# Altium project AT91SAM7S_Demo1.PrjPcb
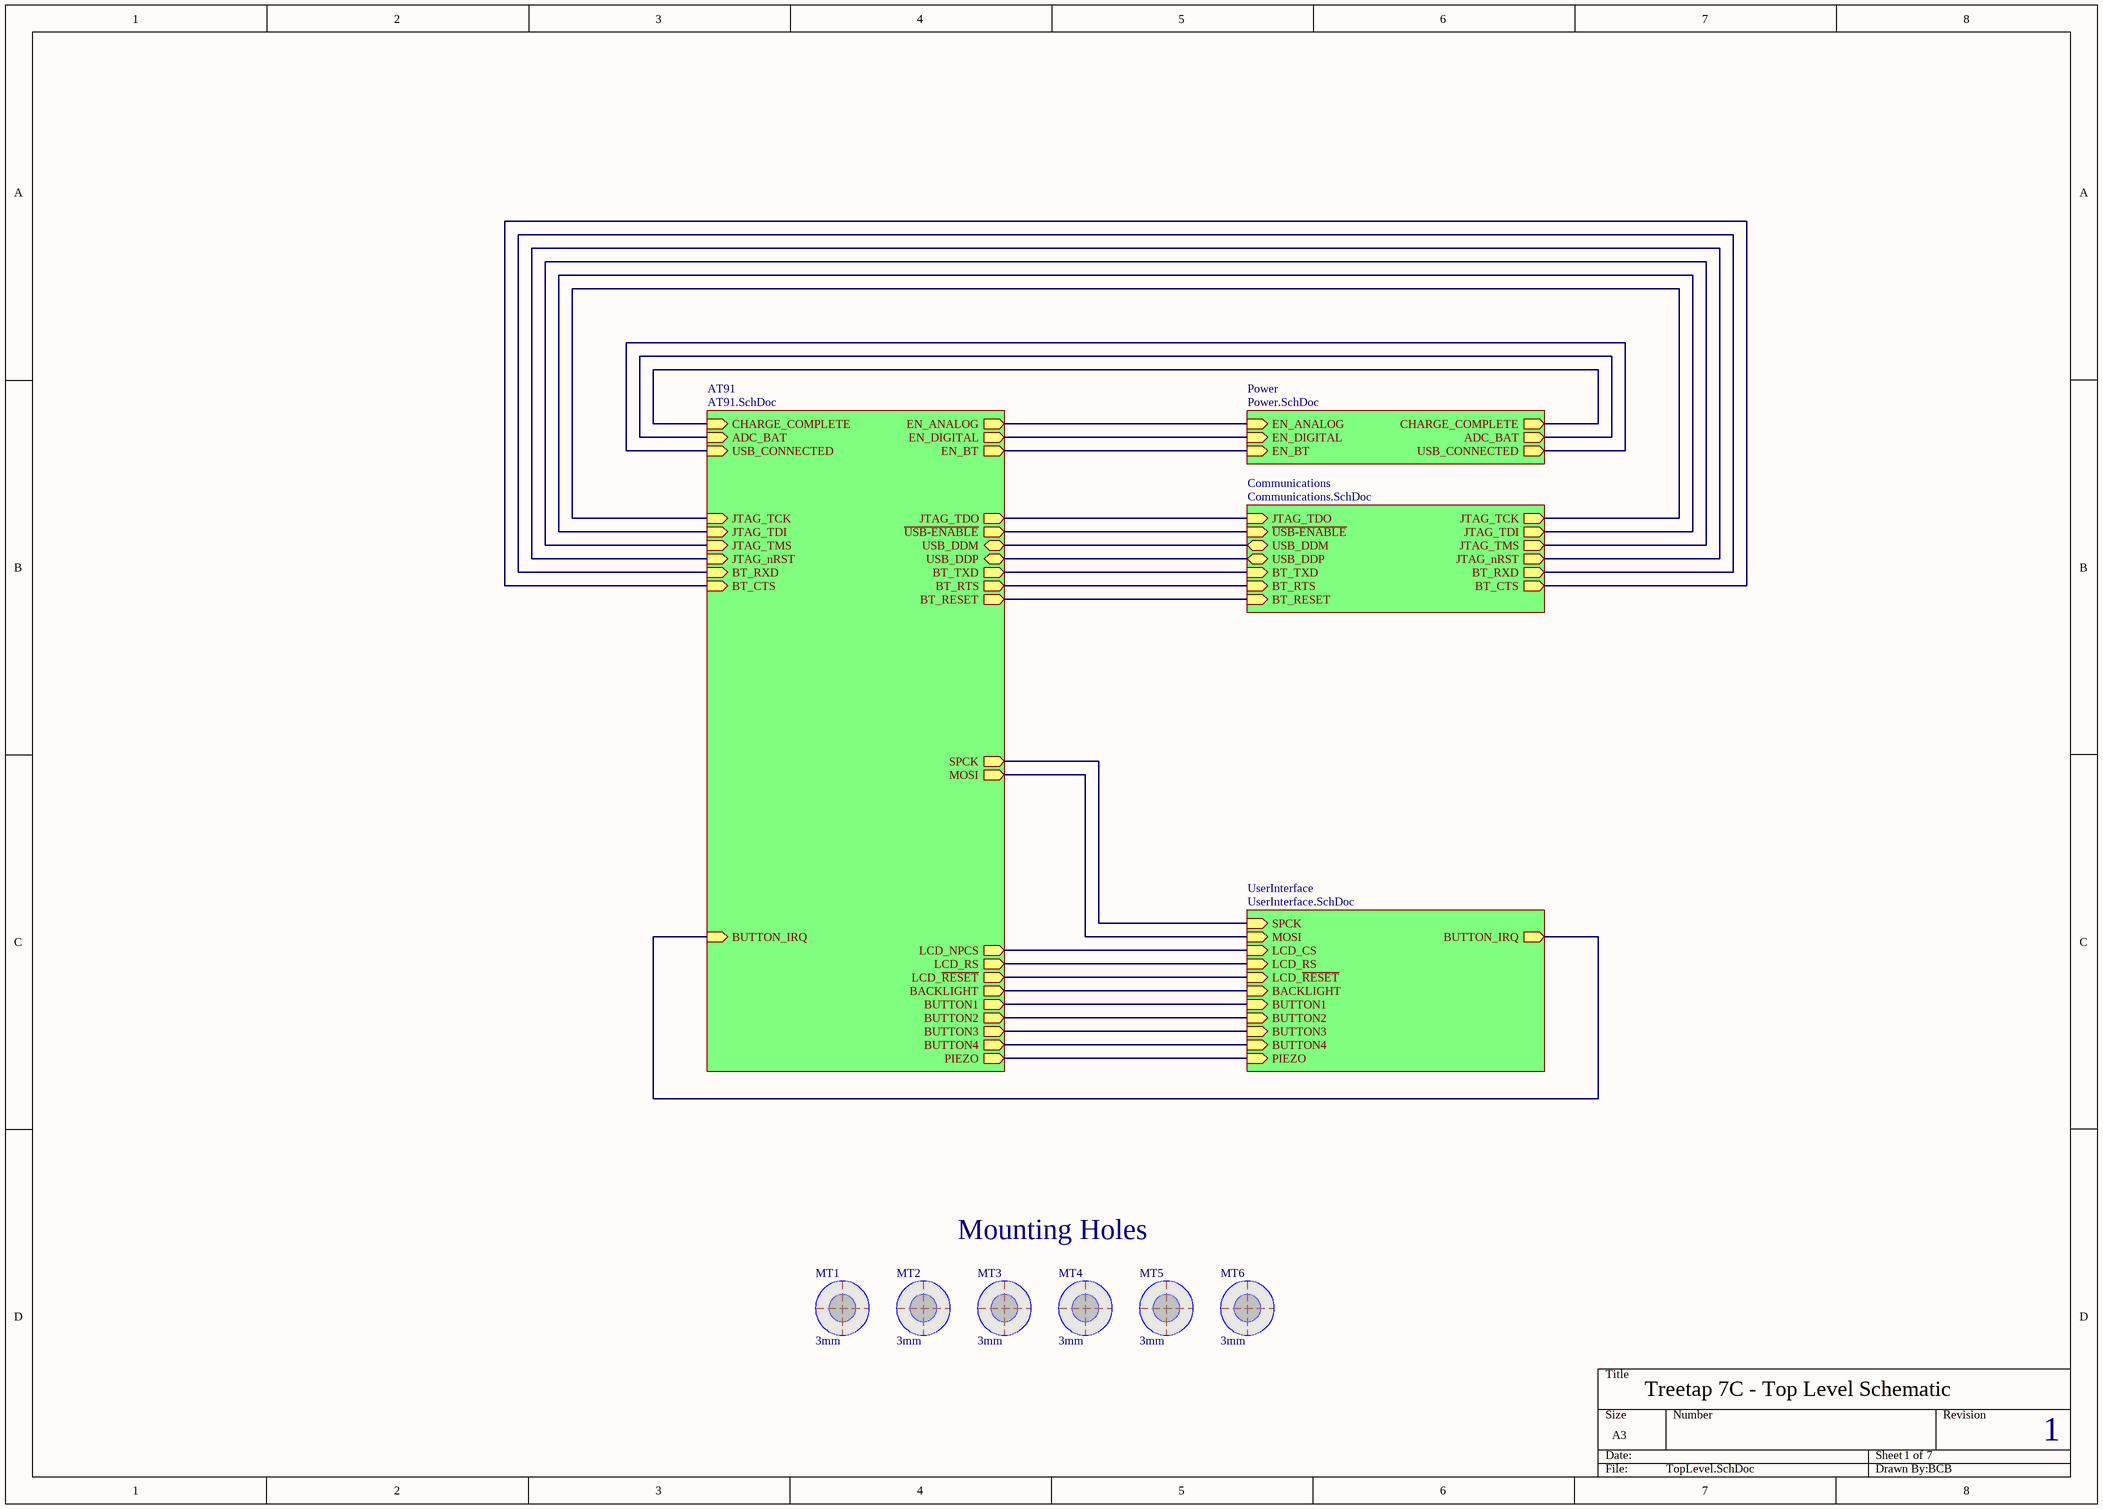
[diagram p0: TopLevel.SchDoc]
5 sheets, 130 parts. Net scope: hierarchical (ports join the sheet entries above them; power ports are global).
Sheets:
  TopLevel.SchDoc
    AT91 = AT91.SchDoc
    Power = Power.SchDoc
    Communications = Communications.SchDoc
    UserInterface = UserInterface.SchDoc

## Sheet TopLevel.SchDoc: Treetap 7C - Top Level Schematic
size A3; Author: Treetap Group; DrawnBy: Treetap Group; Revision: 1; SheetNumber: 1; SheetTotal: 7

### Parts
MT1  3mm  [MNT-HOLE_3mmNPTH]  (no BOM)
MT2  3mm  [MNT-HOLE_3mmNPTH]  (no BOM)
MT3  3mm  [MNT-HOLE_3mmNPTH]  (no BOM)
MT4  3mm  [MNT-HOLE_3mmNPTH]  (no BOM)
MT5  3mm  [MNT-HOLE_3mmNPTH]  (no BOM)
MT6  3mm  [MNT-HOLE_3mmNPTH]  (no BOM)

### Sub-sheets
AT91 = AT91.SchDoc: MOSI (out), SPCK (out), ADC_BAT (in), BUTTON_IRQ (in), BUTTON1 (out), BUTTON2 (out), BT_RESET (out), PIEZO (out), BUTTON3 (out), CHARGE_COMPLETE (in), LCD_NPCS (out), LCD_RS (out), BT_RXD (in), BT_TXD (out), BT_CTS (in), JTAG_TMS (in), JTAG_TCK (in), JTAG_TDO (out), JTAG_TDI (in), JTAG_nRST (in), EN_DIGITAL (out), EN_ANALOG (out), BT_RTS (out), USB_DDM (bidir), USB_DDP (bidir), EN_BT (out), LCD_~{RESET} (out), BACKLIGHT (out), USB_CONNECTED (in), BUTTON4 (out), ~{USB-ENABLE} (out)
Communications = Communications.SchDoc: JTAG_TCK (out), JTAG_TDI (out), JTAG_TDO (in), JTAG_TMS (out), JTAG_nRST (out), USB_DDM (bidir), USB_DDP (bidir), BT_RXD (out), BT_TXD (in), BT_CTS (out), BT_RTS (in), BT_RESET (in), ~{USB-ENABLE} (in)
Power = Power.SchDoc: EN_ANALOG (in), EN_DIGITAL (in), EN_BT (in), CHARGE_COMPLETE (out), ADC_BAT (out), USB_CONNECTED (out)
UserInterface = UserInterface.SchDoc: LCD_RS (in), SPCK (in), MOSI (in), PIEZO (in), BUTTON1 (in), BUTTON2 (in), BUTTON_IRQ (out), BUTTON3 (in), LCD_CS (in), BACKLIGHT (in), LCD_~{RESET} (in), BUTTON4 (in)

### Nets
ADC_BAT: sheet AT91/ADC_BAT, sheet Power/ADC_BAT
BACKLIGHT: sheet AT91/BACKLIGHT, sheet UserInterface/BACKLIGHT
BT_CTS: sheet AT91/BT_CTS, sheet Communications/BT_CTS
BT_RESET: sheet AT91/BT_RESET, sheet Communications/BT_RESET
BT_RTS: sheet AT91/BT_RTS, sheet Communications/BT_RTS
BT_RXD: sheet AT91/BT_RXD, sheet Communications/BT_RXD
BT_TXD: sheet AT91/BT_TXD, sheet Communications/BT_TXD
BUTTON1: sheet AT91/BUTTON1, sheet UserInterface/BUTTON1
BUTTON2: sheet AT91/BUTTON2, sheet UserInterface/BUTTON2
BUTTON3: sheet AT91/BUTTON3, sheet UserInterface/BUTTON3
BUTTON4: sheet AT91/BUTTON4, sheet UserInterface/BUTTON4
BUTTON_IRQ: sheet AT91/BUTTON_IRQ, sheet UserInterface/BUTTON_IRQ
CHARGE_COMPLETE: sheet AT91/CHARGE_COMPLETE, sheet Power/CHARGE_COMPLETE
DDM: sheet AT91/USB_DDM, sheet Communications/USB_DDM
DDP: sheet AT91/USB_DDP, sheet Communications/USB_DDP
EN_ANALOG: sheet AT91/EN_ANALOG, sheet Power/EN_ANALOG
EN_BT: sheet AT91/EN_BT, sheet Power/EN_BT
EN_DIGITAL: sheet AT91/EN_DIGITAL, sheet Power/EN_DIGITAL
LCD_NPCS: sheet AT91/LCD_NPCS, sheet UserInterface/LCD_CS
LCD_RESET: sheet AT91/LCD_~{RESET}, sheet UserInterface/LCD_~{RESET}
LCD_RS: sheet AT91/LCD_RS, sheet UserInterface/LCD_RS
MOSI: sheet AT91/MOSI, sheet UserInterface/MOSI
NRST: sheet AT91/JTAG_nRST, sheet Communications/JTAG_nRST
PIEZO: sheet AT91/PIEZO, sheet UserInterface/PIEZO
SPCK: sheet AT91/SPCK, sheet UserInterface/SPCK
TCK: sheet AT91/JTAG_TCK, sheet Communications/JTAG_TCK
TDI: sheet AT91/JTAG_TDI, sheet Communications/JTAG_TDI
TDO: sheet AT91/JTAG_TDO, sheet Communications/JTAG_TDO
TMS: sheet AT91/JTAG_TMS, sheet Communications/JTAG_TMS
USB_CONNECTED: sheet AT91/USB_CONNECTED, sheet Power/USB_CONNECTED
USB_ENABLE: sheet AT91/~{USB-ENABLE}, sheet Communications/~{USB-ENABLE}

### Notes on the sheet
- Mounting Holes
- Treetap 7C - Top Level Schematic
- 1
- 7
- BCB

### Library data of the parts
MT1-MT6 = MNT-HOLE_3mmNPTH: 3mm Mount hole NPTH; ECE_Component_Code: MNT-HOLE_3.2mmNPTH; Supplier_Component_Code: -; published: 12/03/2007 11:34:37 a.m.; Supplier_Name: -; price: 0; value: 3mm

## Sheet AT91.SchDoc: Treetap 7C - Microprocessor
size A3; Author: Treetap Group; DrawnBy: Treetap Group; Revision: 1; SheetNumber: 2; SheetTotal: 7; PageSetup: Record=PageOptions|CenterHorizontal=True|CenterVertical=True|PrintScale=1.01|XCorrection=1.00|YCorrection=1.00|PrintKind=1|BorderSize=5000000|LeftOffset=0|BottomOffset=0|Orientation=2|PaperLength=1000|PaperWidth=1000|Scale=100|PaperSource=15|PrintQuality=600|MediaType=1|DitherType=10|PaperKind=A3|PrintScaleMode=1
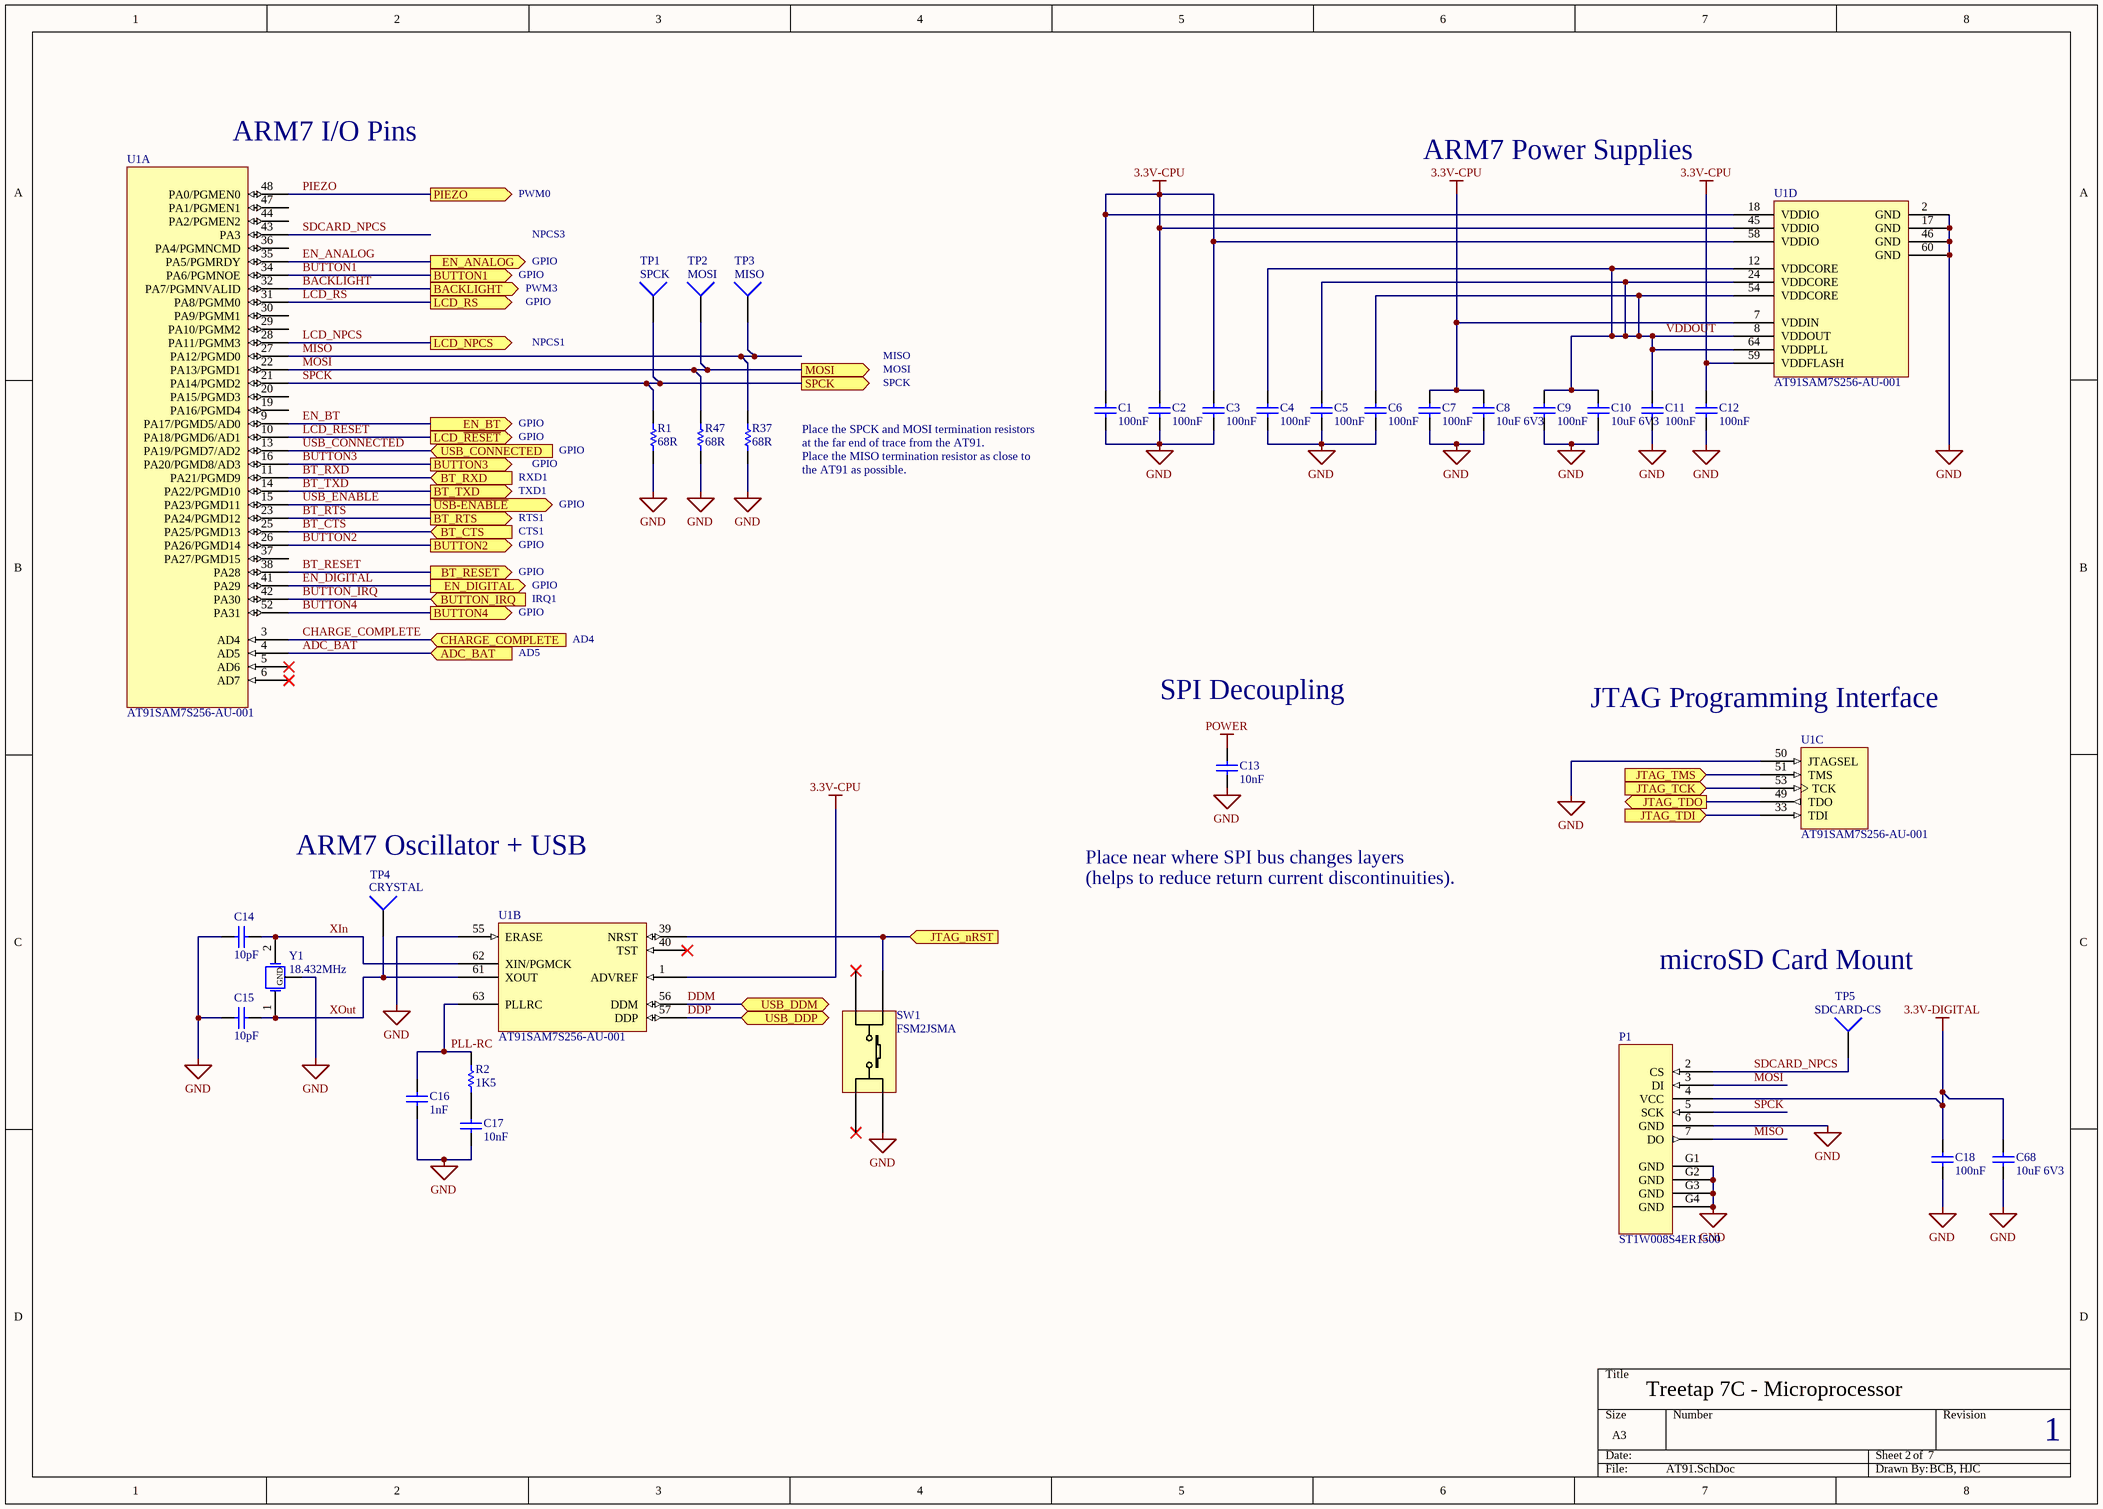
[diagram p1: AT91.SchDoc]

### Parts
C1  100nF  [CC0603]
C2  100nF  [CC0603]
C3  100nF  [CC0603]
C4  100nF  [CC0603]
C5  100nF  [CC0603]
C6  100nF  [CC0603]
C7  100nF  [CC0603]
C8  10uF 6V3  [CC0603]
C9  100nF  [CC0603]
C10  10uF 6V3  [CC0603]
C11  100nF  [CC0603]
C12  100nF  [CC0603]
C13  10nF  [CC0603]
C14  10pF  [CC0603]
C15  10pF  [CC0603]
C16  1nF  [CC0603]
C17  10nF  [CC0603]
C18  100nF  [CC0603]
C68  10uF 6V3  [CC0603]
P1  ST1W008S4ER1500  [ST1W008S4ER1500]
R1  68R  [R0603]
R2  1K5  [R0603]
R37  68R  [R0603]
R47  68R  [R0603]
SW1  FSM2JSMA  [FSM2JSMA]
TP1  SPCK  [SMTP_1]
TP2  MOSI  [SMTP_1]
TP3  MISO  [SMTP_1]
TP4  CRYSTAL  [SMTP_1]
TP5  SDCARD-CS  [SMTP_1]
U1  AT91SAM7S256-AU-001  [LQFP64_L]  (parts A,B,C,D of 4)
Y1  18.432MHz  [ABM10-18.432MHZ-E20-T]

### Ports
ADC_BAT (in), BACKLIGHT (out), BT_CTS (in), BT_RESET (out), BT_RTS (out), BT_RXD (in), BT_TXD (out), BUTTON1 (out), BUTTON2 (out), BUTTON3 (out), BUTTON4 (out), BUTTON_IRQ (in), CHARGE_COMPLETE (in), EN_ANALOG (out), EN_BT (out), EN_DIGITAL (out), JTAG_nRST (in), JTAG_TCK (in), JTAG_TDI (in), JTAG_TDO (out), JTAG_TMS (in), LCD_NPCS (out), LCD_RS (out), LCD_~{RESET} (out), MOSI (out), PIEZO (out), SPCK (out), USB_CONNECTED (in), USB_DDM (bidir), USB_DDP (bidir), ~{USB-ENABLE} (out)

### Nets
3.3V-CPU: C1.2 C2.2 C3.1 C7.1 C8.2 C12.2 U1.1(ADVREF) U1.7(VDDIN) U1.18(VDDIO) U1.45(VDDIO) U1.58(VDDIO) U1.59(VDDFLASH)
3.3V-DIGITAL: C18.2 C68.2 P1.4(VCC)
GND: C1.1 C2.1 C3.2 C4.1 C5.1 C6.1 C7.2 C8.1 C9.2 C10.1 C11.1 C12.1 C13.1 C14.2 C15.1 C16.1 C17.1 C18.1 C68.1 P1.6(GND) P1.G1(GND) P1.G2(GND) P1.G3(GND) P1.G4(GND) R1.1 R37.1 R47.1 SW1.4 U1.2(GND) U1.17(GND) U1.46(GND) U1.50(JTAGSEL) U1.55(ERASE) U1.60(GND) Y1.G(GND)
POWER: C13.2
ADC_BAT: U1.4(AD5) ; port ADC_BAT
BACKLIGHT: U1.32(PA7/PGMNVALID) ; port BACKLIGHT
BT_CTS: U1.25(PA25/PGMD13) ; port BT_CTS
BT_RESET: U1.38(PA28) ; port BT_RESET
BT_RTS: U1.23(PA24/PGMD12) ; port BT_RTS
BT_RXD: U1.11(PA21/PGMD9) ; port BT_RXD
BT_TXD: U1.14(PA22/PGMD10) ; port BT_TXD
BUTTON1: U1.34(PA6/PGMNOE) ; port BUTTON1
BUTTON2: U1.26(PA26/PGMD14) ; port BUTTON2
BUTTON3: U1.16(PA20/PGMD8/AD3) ; port BUTTON3
BUTTON4: U1.52(PA31) ; port BUTTON4
BUTTON_IRQ: U1.42(PA30) ; port BUTTON_IRQ
CHARGE_COMPLETE: U1.3(AD4) ; port CHARGE_COMPLETE
DDM: U1.56(DDM) ; port USB_DDM
DDP: U1.57(DDP) ; port USB_DDP
EN_ANALOG: U1.35(PA5/PGMRDY) ; port EN_ANALOG
EN_BT: U1.9(PA17/PGMD5/AD0) ; port EN_BT
EN_DIGITAL: U1.41(PA29) ; port EN_DIGITAL
LCD_NPCS: U1.28(PA11/PGMM3) ; port LCD_NPCS
LCD_RESET: U1.10(PA18/PGMD6/AD1) ; port LCD_~{RESET}
LCD_RS: U1.31(PA8/PGMM0) ; port LCD_RS
MISO: P1.7(DO) R37.2 TP3.1 U1.27(PA12/PGMD0)
MOSI: P1.3(DI) R47.2 TP2.1 U1.22(PA13/PGMD1) ; port MOSI
NRST: SW1.1 U1.39(NRST) ; port JTAG_nRST
PIEZO: U1.48(PA0/PGMEN0) ; port PIEZO
PLL-RC: C16.2 R2.2 U1.63(PLLRC)
SDCARD_NPCS: P1.2(CS) TP5.1 U1.43(PA3)
SPCK: P1.5(SCK) R1.2 TP1.1 U1.21(PA14/PGMD2) ; port SPCK
TCK: U1.53(TCK) ; port JTAG_TCK
TDI: U1.33(TDI) ; port JTAG_TDI
TDO: U1.49(TDO) ; port JTAG_TDO
TMS: U1.51(TMS) ; port JTAG_TMS
USB_CONNECTED: U1.13(PA19/PGMD7/AD2) ; port USB_CONNECTED
USB_ENABLE: U1.15(PA23/PGMD11) ; port ~{USB-ENABLE}
VDDOUT: C4.2 C5.2 C6.2 C9.1 C10.2 C11.2 U1.8(VDDOUT) U1.12(VDDCORE) U1.24(VDDCORE) U1.54(VDDCORE) U1.64(VDDPLL)
XIn: C14.1 U1.62(XIN/PGMCK) Y1.2(OSC2)
XOut: C15.2 TP4.1 U1.61(XOUT) Y1.1(OSC1)
NetC17_2: C17.2 R2.1

Not connected (* = marked no-connect by the designer): SW1 2* 3*; U1 5(AD6)* 6(AD7)* 19(PA16/PGMD4) 20(PA15/PGMD3) 29(PA10/PGMM2) 30(PA9/PGMM1) 36(PA4/PGMNCMD) 37(PA27/PGMD15) 40(TST)* 44(PA2/PGMEN2) 47(PA1/PGMEN1)

### Notes on the sheet
- (near U1) ARM7 I/O Pins
- ARM7 Power Supplies
- PWM0
- NPCS3
- GPIO
- PWM3
- NPCS1
- MISO
- MOSI
- (near C1) Place the SPCK and MOSI termination resistors
- at the far end of trace from the AT91.
- SPCK
- RXD1
- TXD1
- Place the MISO termination resistor as close to
- the AT91 as possible.
- CTS1
- RTS1
- IRQ1
- AD4
- AD5
- SPI Decoupling
- (near U1) JTAG Programming Interface
- ARM7 Oscillator + USB
- Place near where SPI bus changes layers
- (helps to reduce return current discontinuities).
- microSD Card Mount
- Treetap 7C - Microprocessor
- 2
- 7
- 1
- BCB, HJC

### Library data of the parts
C1-C7 C9 C11 C12 C18 = 100nF_CC0603: 0603 Capacitor; Supplier_Component_Code: RC-P100; published: 28/03/2007 10:54:57 a.m.; Supplier_Name: Soanar Plus; price: 0.09; value: 100nF; Part Number: 100nF_CC0603; Component Kind: Standard; Component Type: Standard; Designator: 100nF_CC0603; Pin Count: 2
C8 C10 C68 = 10uF_CC0603_6V3: 10uF 6.3V 0603 ceramic capacitor; Manufacturer: Multicomp; Part Number: MCCA000517; Supplier_Component_Code: 1759393; published: 8/06/2010; Supplier_Name: Farnell; price: 0.218; value: 10uF 6V3
C13 C17 = 10nF_CC0603: 0603 Capacitor; Supplier_Component_Code: RC-P097; published: 28/03/2007 10:54:57 a.m.; Supplier_Name: Soanar Plus; price: 0.09; value: 10nF; Part Number: 10nF_CC0603; Component Kind: Standard; Component Type: Standard; Designator: 10nF_CC0603; Pin Count: 2
C14 C15 = 10pF_CC0603: 0603 Capacitor; Supplier_Component_Code: RC-P050; published: 28/03/2007 10:54:57 a.m.; Supplier_Name: Soanar Plus; price: 0.06; value: 10pF; Part Number: 10pF_CC0603; Component Kind: Standard; Component Type: Standard; Designator: 10pF_CC0603; Pin Count: 2
C16 = 1nF_CC0603: 0603 Capacitor; Supplier_Component_Code: RC-P062; published: 28/03/2007 10:54:57 a.m.; Supplier_Name: Soanar Plus; price: 0.09; value: 1nF; Part Number: 1nF_CC0603; Component Kind: Standard; Component Type: Standard; Designator: 1nF_CC0603; Pin Count: 2
P1 = ST1W008S4ER1500: microSD mount; Manufacturer: JAE; Order multiple: 1; Supplier_Name: Farnell; Supplier_Component_Code: 1702072; price: 4.55; value: ST1W008S4ER1500; Part Number: ST1W008S4ER1500; Pack of: 1
R1 R37 R47 = 68R_R0603: 0603 Resistor; ECE_Component_Code: 68R_R0603; value: 68R; Supplier_Component_Code: RS-S045; published: 12/03/2007 11:34:34 a.m.; Supplier_Name: Soanar Plus; price: 0.08; Part Number: 68R_R0603; Component Kind: Standard; Component Type: Standard; Designator: 68R_R0603; Pin Count: 2
R2 = 1K5_R0603: 0603 Resistor; ECE_Component_Code: 1K5_R0603; value: 1K5; Supplier_Component_Code: RS-S077; published: 12/03/2007 11:34:34 a.m.; Supplier_Name: Soanar Plus; price: 0.08; Part Number: 1K5_R0603; Component Kind: Standard; Component Type: Standard; Designator: 1K5_R0603; Pin Count: 2
SW1 = FSM2JSMA: DPST SMD Switch; Manufacturer: Tyco Electronics; Pack of: 1; Supplier_Name: Farnell; Supplier_Component_Code: 3801287; price: 0.516; Part Number: FSM2JSMA; Order multiple: 1; value: FSM2JSMA
TP1-TP5 = SMTestPoint: Test point hook (surface mount); Manufacturer: Harwin; Part Number: S1751-46; Order Multiple: 1; Pack of: 100; price: 40.01; published: 15/02/2010; Supplier_Name: Farnell; Supplier_Component_Code: 1022338; value: SMTestPoint
U1 = AT91SAM7S256-AU-001: Smart ARM Microcontroller, ARM7TDMI 32-Bit RISC CPU, 256KB Flash and 64KB SRAM, 64-Pin LQFP, Industrial, Pb-Free; Manufacturer: Atmel; Pack of: 1; ComponentLink1Description: Manufacturer Link; ComponentLink1URL: http://www.atmel.com; ComponentLink2Description: Datasheet; ComponentLink2URL: http://www.atmel.com/dyn/resources/prod_documents/6175s.pdf; price: 18.69; published: 15/02/2010; Supplier_Name: Farnell; Supplier_Component_Code: 1095460; value: AT91SAM7S256-AU-001; Part Number: AT91SAM7S256; Order multiple: 1
Y1 = ABM10-18.432MHZ-E20-T: 18.432MHz SMT crystal 2x2.5mm 20ppm; Manufacturer: Abracon Corporation; Pack of: 1; Part Number: ABM10-18.432MHZ-E20-T; Supplier_Component_Code: 535-9813-1-ND; published: 03/06/2010; Supplier_Name: Digikey; price: 3.79; Order multiple: 1; value: 18.432MHz

## Sheet Power.SchDoc: Treetap 7C - Power Supply
size A3; Author: Treetap Group; DrawnBy: Treetap Group; Revision: 1; SheetNumber: 3; SheetTotal: 7; PageSetup: Record=PageOptions|CenterHorizontal=True|CenterVertical=True|PrintScale=1.01|XCorrection=1.00|YCorrection=1.00|PrintKind=1|BorderSize=5000000|LeftOffset=0|BottomOffset=0|Orientation=2|PaperLength=1000|PaperWidth=1000|Scale=100|PaperSource=15|PrintQuality=600|MediaType=1|DitherType=10|PaperKind=A3|PrintScaleMode=1
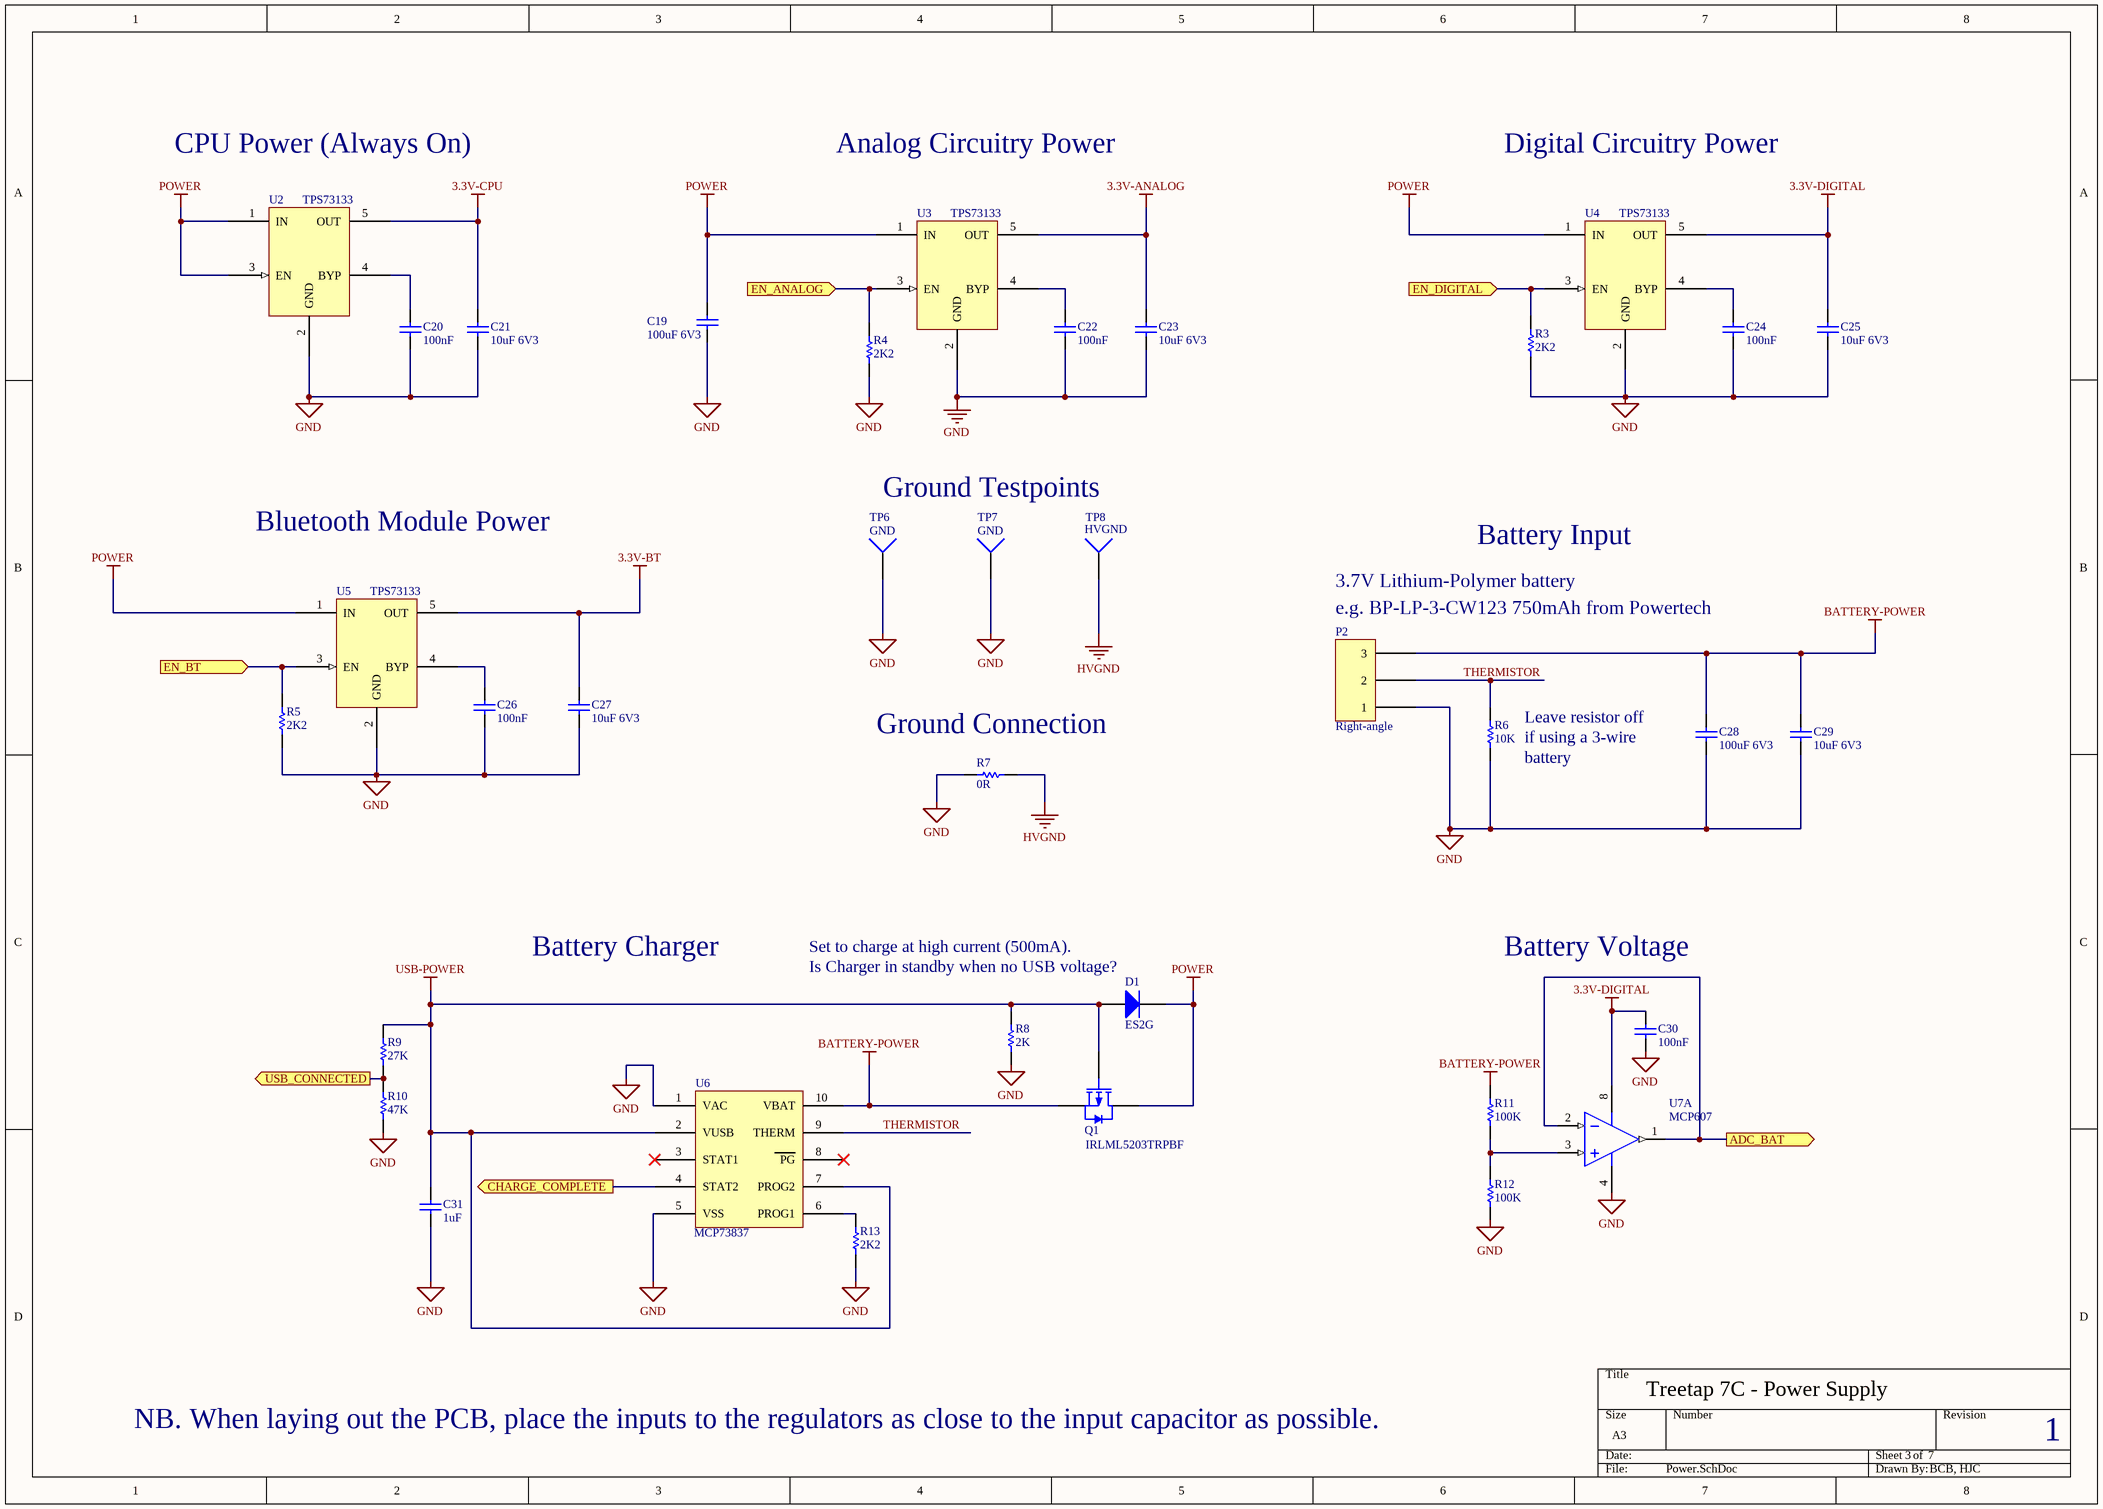
[diagram p2: Power.SchDoc]

### Parts
C19  100uF 6V3  [CC1206]
C20  100nF  [CC0603]
C21  10uF 6V3  [CC0603]
C22  100nF  [CC0603]
C23  10uF 6V3  [CC0603]
C24  100nF  [CC0603]
C25  10uF 6V3  [CC0603]
C26  100nF  [CC0603]
C27  10uF 6V3  [CC0603]
C28  100uF 6V3  [CC1206]
C29  10uF 6V3  [CC0603]
C30  100nF  [CC0603]
C31  1uF  [CC0603]
D1  ES2G  [DO214AA (SMB)]
P2  Right-angle  [3pinheader]
Q1  IRLML5203TRPBF  [SOT-23]
R3  2K2  [R0603]
R4  2K2  [R0603]
R5  2K2  [R0603]
R6  10K  [R0603]
R7  0R  [R0603]
R8  2K  [R0603]
R9  27K  [R0603]
R10  47K  [R0603]
R11  100K  [R0603]
R12  100K  [R0603]
R13  2K2  [R0603]
TP6  GND  [SMTP_1]
TP7  GND  [ThroughHoleTP]
TP8  HVGND  [SMTP_1]
U2  TPS73133  [DBV005]
U3  TPS73133  [DBV005]
U4  TPS73133  [DBV005]
U5  TPS73133  [DBV005]
U6  MCP73837  [10-MSOP]
U7  MCP607  [MS-012]  (part A of 2)

### Ports
ADC_BAT (out), CHARGE_COMPLETE (out), EN_ANALOG (in), EN_BT (in), EN_DIGITAL (in), USB_CONNECTED (out)

### Nets
3.3V-ANALOG: C23.2 U3.5(OUT)
3.3V-BT: C27.2 U5.5(OUT)
3.3V-CPU: C21.2 U2.5(OUT)
3.3V-DIGITAL: C25.2 C30.2 U4.5(OUT) U7.8(V+)
BATTERY-POWER: C28.1 C29.2 P2.3 Q1.3(D) R11.2 U6.10(VBAT)
GND: C19.1 C20.2 C21.1 C22.2 C23.1 C24.2 C25.1 C26.2 C27.1 C28.2 C29.1 C30.1 C31.1 P2.1 R3.1 R4.1 R5.1 R6.1 R7.1 R8.1 R10.1 R12.1 R13.1 TP6.1 TP7.1 U2.2(GND) U3.2(GND) U4.2(GND) U5.2(GND) U6.1(VAC) U6.5(VSS) U7.4(GND)
HVGND: R7.2 TP8.1
POWER: C19.2 D1.2(K) Q1.2(S) U2.1(IN) U2.3(EN) U3.1(IN) U4.1(IN) U5.1(IN)
USB-POWER: C31.2 D1.1(A) Q1.1(G) R8.2 R9.2 U6.2(VUSB) U6.7(PROG2)
ADC_BAT: U7.1(OUT) U7.2(IN-) ; port ADC_BAT
CHARGE_COMPLETE: U6.4(STAT2) ; port CHARGE_COMPLETE
EN_ANALOG: R4.2 U3.3(EN) ; port EN_ANALOG
EN_BT: R5.2 U5.3(EN) ; port EN_BT
EN_DIGITAL: R3.2 U4.3(EN) ; port EN_DIGITAL
THERMISTOR: P2.2 R6.2 U6.9(THERM)
USB_CONNECTED: R9.1 R10.2 ; port USB_CONNECTED
NetC20_1: C20.1 U2.4(BYP)
NetC22_1: C22.1 U3.4(BYP)
NetC24_1: C24.1 U4.4(BYP)
NetC26_1: C26.1 U5.4(BYP)
NetR11_1: R11.1 R12.2 U7.3(IN+)
NetR13_2: R13.2 U6.6(PROG1)

Not connected (* = marked no-connect by the designer): U6 3(STAT1)* 8(PG)*

### Notes on the sheet
- CPU Power (Always On)
- Analog Circuitry Power
- Digital Circuitry Power
- Ground Testpoints
- Bluetooth Module Power
- 3.7V Lithium-Polymer battery
- Battery Input
- (near P2) e.g. BP-LP-3-CW123 750mAh from Powertech
- Leave resistor off
- (near R7) Ground Connection
- if using a 3-wire
- (near R6) battery
- Battery Charger
- Set to charge at high current (500mA).
- (near D1) Is Charger in standby when no USB voltage?
- Battery Voltage
- Treetap 7C - Power Supply
- NB. When laying out the PCB, place the inputs to the regulators as close to the input capacitor as possible.
- 3
- 7
- 1
- BCB, HJC

### Library data of the parts
C19 C28 = 100uF_1206_6V3: 100uF 6.3V 1206 multi-layer ceramic capacitor; Part Number: C1206C107M9PACTU; Manufacturer: Kemet; Supplier_Component_Code: 399-5620-1-ND; published: 08/06/2010; Supplier_Name: Digikey; price: 2.56; Type: Ceramic; value: 100uF 6V3
C20 C22 C24 C26 C30 = 100nF_CC0603: 0603 Capacitor; Supplier_Component_Code: RC-P100; published: 28/03/2007 10:54:57 a.m.; Supplier_Name: Soanar Plus; price: 0.09; value: 100nF; Part Number: 100nF_CC0603; Component Kind: Standard; Component Type: Standard; Designator: 100nF_CC0603; Pin Count: 2
C21 C23 C25 C27 C29 = 10uF_CC0603_6V3: as C8 on sheet AT91; Supplier_Component_Code: 1759393; published: 8/06/2010; Supplier_Name: Farnell; price: 0.218; value: 10uF 6V3
C31 = 1uF_0603_25V_ceramic: 1uF 25V 0603 ceramic capacitor; Manufacturer: Kemet; Part Number: C0603C105K3PAC; Order multiple: 10; Pack of: 1; Supplier_Component_Code: 1288202; published: 15/02/2010; Supplier_Name: Farnell; price: 0.465; value: 1uF
D1 = ES2G: Fast 2A 400V SMB diode, Vishay Semiconductor; Manufacturer: Vishay General Semiconductor; Pack of: 1; Order multiple: 5; Supplier_Name: Farnell; Supplier_Component_Code: 1215107; price: 2.32; published: 15/02/2010; value: ES2G; Part Number: ES2G
P2 = 3pinheader: 3 pin 2.54mm pitch right-angle header; Manufacturer: (Multi-sourced part); Pack of: 1; Supplier_Component_Code: HM3423; published: 14/01/2008; Supplier_Name: Soanar Plus; price: 0.18; value: Right-angle; Part Number: -; Order multiple: 1
Q1 = IRLML5203TRPBF: 30V P-channel enhancement mode MOSFET; Manufacturer: International Rectifier; Part Number: IRLML5203PBF; Order multiple: 5; Pack of: 1; Supplier_Name: Farnell; Supplier_Component_Code: 9103511; price: 0.98; published: 15/02/2010; value: IRLML5203TRPBF
R3-R5 R13 = 2K2_R0603: 0603 Resistor; ECE_Component_Code: 2K2_R0603; value: 2K2; Supplier_Component_Code: RS-S081; published: 12/03/2007 11:34:34 a.m.; Supplier_Name: Soanar Plus; price: 0.08; Part Number: 2K2_R0603; Component Kind: Standard; Component Type: Standard; Designator: 2K2_R0603; Pin Count: 2
R6 = 10K_R0603: 0603 Resistor; ECE_Component_Code: 10K_R0603; value: 10K; Supplier_Component_Code: RS-S097; published: 12/03/2007 11:34:34 a.m.; Supplier_Name: Soanar Plus; price: 0.08; Part Number: 10K_R0603; Component Kind: Standard; Component Type: Standard; Designator: 10K_R0603; Pin Count: 2
R7 = 0R_R0603: 0603 Resistor; ECE_Component_Code: 0R_R0603; Supplier_Component_Code: RS-S000; published: 12/03/2007 11:34:33 a.m.; Supplier_Name: Soanar Plus; price: 0.08; value: 0R; Part Number: 0R_R0603; Component Kind: Standard; Component Type: Standard; Designator: 0R_R0603; Pin Count: 2
R8 = 2K_R0603: 0603 Resistor; ECE_Component_Code: 2K_R0603; value: 2K; Supplier_Component_Code: RS-S080; published: 12/03/2007 11:34:34 a.m.; Supplier_Name: Soanar Plus; price: 0.08; Part Number: 2K_R0603; Component Kind: Standard; Component Type: Standard; Designator: 2K_R0603; Pin Count: 2
R9 = 27K_R0603: 0603 Resistor; ECE_Component_Code: 27K_R0603; value: 27K; Supplier_Component_Code: RS-S107; published: 12/03/2007 11:34:34 a.m.; Supplier_Name: Soanar Plus; price: 0.08; Part Number: 27K_R0603; Component Kind: Standard; Component Type: Standard; Designator: 27K_R0603; Pin Count: 2
R10 = 47K_R0603: 0603 Resistor; ECE_Component_Code: 47K_R0603; value: 47K; Supplier_Component_Code: RS-S113; published: 12/03/2007 11:34:34 a.m.; Supplier_Name: Soanar Plus; price: 0.08; Part Number: 47K_R0603; Component Kind: Standard; Component Type: Standard; Designator: 47K_R0603; Pin Count: 2
R11 R12 = 100K_R0603: 0603 Resistor; ECE_Component_Code: 100K_R0603; value: 100K; Supplier_Component_Code: RS-S121; published: 12/03/2007 11:34:34 a.m.; Supplier_Name: Soanar Plus; price: 0.08; Part Number: 100K_R0603; Component Kind: Standard; Component Type: Standard; Designator: 100K_R0603; Pin Count: 2
TP6 TP8 = SMTestPoint: Test point hook (surface mount); Manufacturer: Harwin; Part Number: S1751-46; price: 0.43; published: 15/02/2010; Supplier_Name: Farnell; Supplier_Component_Code: 1022338; value: SMTestPoint
TP7 = ThroughHoleTP: Through hole testpoint - intended for a loop of wire.
U2-U5 = TPS73133: 150mA 3.3V linear regulator with 30mV dropout; Manufacturer: Texas Instruments; Part Number: TPS73133DBVTG4; Pack of: 1; Supplier_Name: Farnell; Supplier_Component_Code: 1207341; price: 0.84; published: 15/02/2010; datasheet_document: http://www.ti.com/lit/gpn/tps73133; value: TPS73133; Order multiple: 1
U6 = MCP73837: USB Lithium Battery Charger; Manufacturer: Microchip; Part Number: MCP73837-FCI/UN; Order multiple: 1; Supplier_Name: Farnell; Supplier_Component_Code: 1675426; price: 1.58; value: MCP73837; Pack of: 1
U7 = MCP607: Dual micropower CMOS opamp; Manufacturer: Microchip; Part Number: MCP607-I/SN; Pack of: 1; datasheet_document: http://ww1.microchip.com/downloads/en/DeviceDoc/11177d.pdf; price: 1.92; Supplier_Name: Farnell; published: 21/12/2007; Supplier_Component_Code: 1196812; value: MCP607; Order multiple: 1

## Sheet Communications.SchDoc: Treetap 7C - USB & JTAG Interface
size A3; Author: Treetap Group; DrawnBy: Treetap Group; Revision: 1; SheetNumber: 4; SheetTotal: 7; PageSetup: Record=PageOptions|CenterHorizontal=True|CenterVertical=True|PrintScale=1.03|XCorrection=1.00|YCorrection=1.00|PrintKind=1|BorderSize=5000000|LeftOffset=0|BottomOffset=0|Orientation=2|PaperLength=1000|PaperWidth=1000|Scale=100|PaperSource=15|PrintQuality=600|MediaType=1|DitherType=10|PaperKind=A4|PrintScaleMode=1
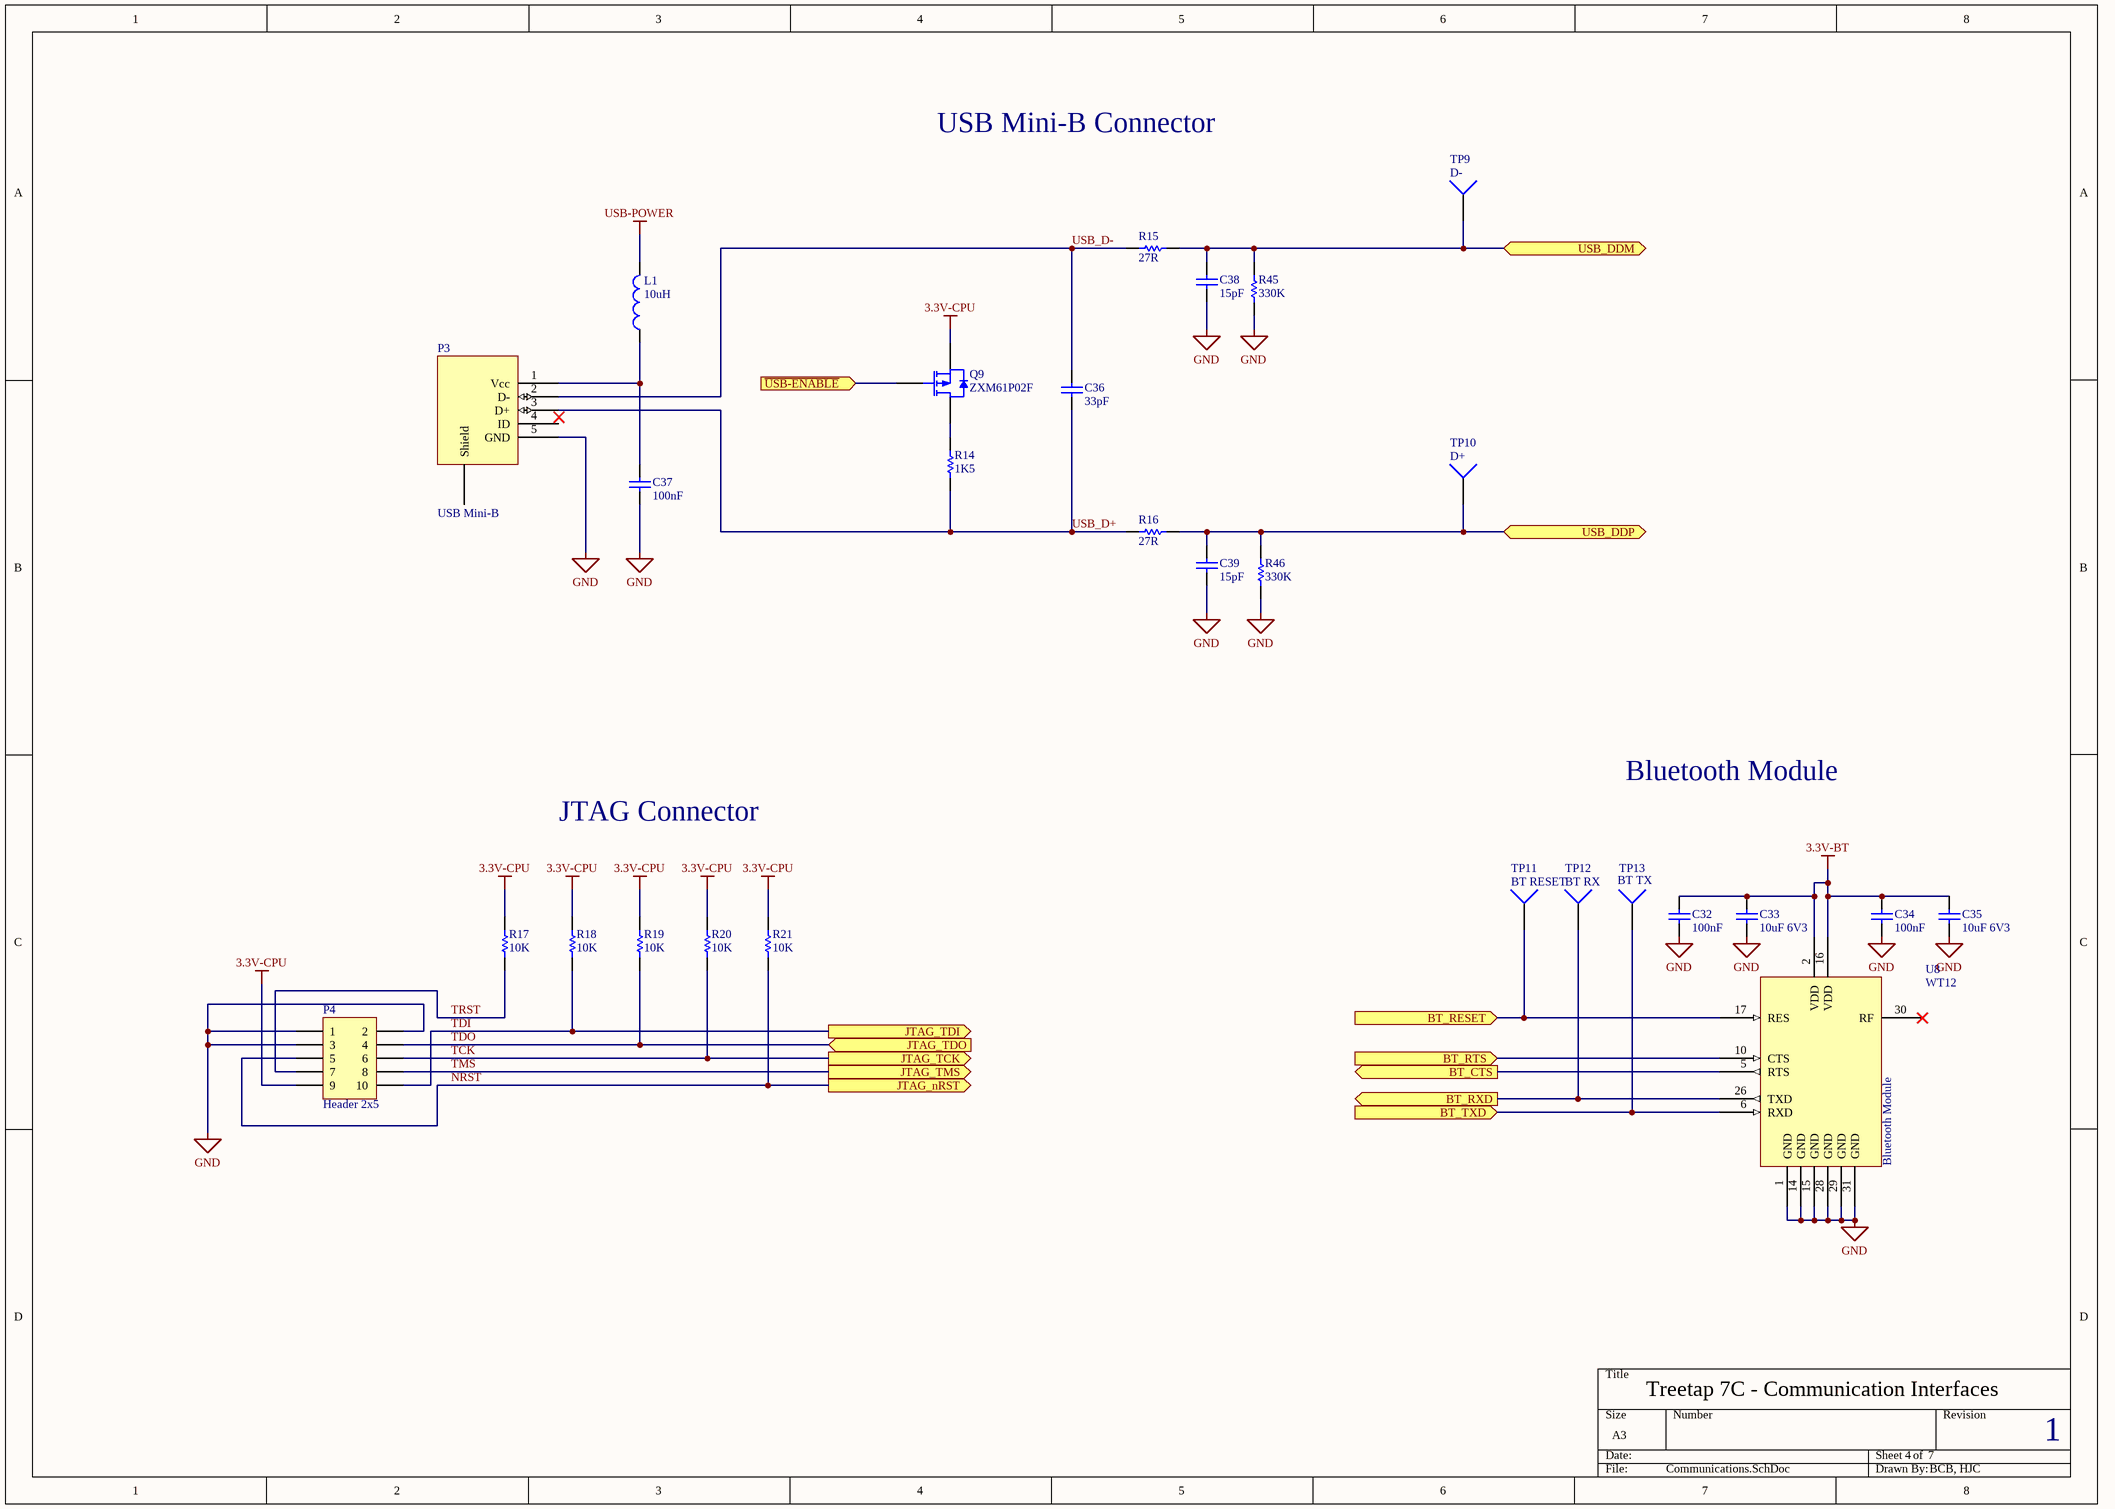
[diagram p3: Communications.SchDoc]

### Parts
C32  100nF  [CC0603]
C33  10uF 6V3  [CC0603]
C34  100nF  [CC0603]
C35  10uF 6V3  [CC0603]
C36  33pF  [CC0603]
C37  100nF  [CC0603]
C38  15pF  [CC0603]
C39  15pF  [CC0603]
L1  10uH  [0805]
P3  USB Mini-B  [USBminiB]
P4  Header 2x5  [HEADER 2x5]
Q9  ZXM61P02F  [SOT-23]
R14  1K5  [R0603]
R15  27R  [R0603]
R16  27R  [R0603]
R17  10K  [R0603]
R18  10K  [R0603]
R19  10K  [R0603]
R20  10K  [R0603]
R21  10K  [R0603]
R45  330K  [R0603]
R46  330K  [R0603]
TP9  D-  [SMTP_1]
TP10  D+  [SMTP_1]
TP11  BT RESET  [SMTP_1]
TP12  BT RX  [SMTP_1]
TP13  BT TX  [SMTP_1]
U8  WT12  [WT12_Bluetooth]

### Ports
BT_CTS (out), BT_RESET (in), BT_RTS (in), BT_RXD (out), BT_TXD (in), JTAG_nRST (out), JTAG_TCK (out), JTAG_TDI (out), JTAG_TDO (in), JTAG_TMS (out), USB_DDM (bidir), USB_DDP (bidir), ~{USB-ENABLE} (in)

### Nets
3.3V-BT: C32.2 C33.2 C34.2 C35.2 U8.2(VDD) U8.16(VDD)
3.3V-CPU: P4.9 Q9.2(S) R17.2 R18.2 R19.2 R20.2 R21.2
GND: C32.1 C33.1 C34.1 C35.1 C37.1 C38.1 C39.1 P3.5(GND) P4.1 P4.2 P4.3 R45.1 R46.1 U8.1(GND) U8.14(GND) U8.15(GND) U8.28(GND) U8.29(GND) U8.31(GND)
USB-POWER: L1.2
BT_CTS: U8.5(RTS) ; port BT_CTS
BT_RESET: TP11.1 U8.17(RES) ; port BT_RESET
BT_RTS: U8.10(CTS) ; port BT_RTS
BT_RXD: TP12.1 U8.26(TXD) ; port BT_RXD
BT_TXD: TP13.1 U8.6(RXD) ; port BT_TXD
DDM: C38.2 R15.2 R45.2 TP9.1 ; port USB_DDM
DDP: C39.2 R16.2 R46.2 TP10.1 ; port USB_DDP
NRST: P4.5 R21.1 ; port JTAG_nRST
TCK: P4.6 R20.1 ; port JTAG_TCK
TDI: P4.10 R18.1 ; port JTAG_TDI
TDO: P4.4 R19.1 ; port JTAG_TDO
TMS: P4.8 ; port JTAG_TMS
TRST: P4.7 R17.1
USB_D+: C36.1 P3.3(D+) R14.1 R16.1
USB_D-: C36.2 P3.2(D-) R15.1
USB_ENABLE: Q9.1(G) ; port ~{USB-ENABLE}
NetC37_2: C37.2 L1.1 P3.1(Vcc)
NetQ9_3: Q9.3(D) R14.2

Not connected (* = marked no-connect by the designer): P3 4(ID) Shield; U8 30(RF)*

### Notes on the sheet
- USB Mini-B Connector
- Bluetooth Module
- JTAG Connector
- Treetap 7C - Communication Interfaces
- 4
- 7
- 1
- BCB, HJC
- (in symbol WT12_Bluetooth) Bluetooth Module

### Library data of the parts
C32 C34 C37 = 100nF_CC0603: 0603 Capacitor; Supplier_Component_Code: RC-P100; published: 28/03/2007 10:54:57 a.m.; Supplier_Name: Soanar Plus; price: 0.09; value: 100nF; Part Number: 100nF_CC0603; Component Kind: Standard; Component Type: Standard; Designator: 100nF_CC0603; Pin Count: 2
C33 C35 = 10uF_CC0603_6V3: as C8 on sheet AT91; Supplier_Component_Code: 1759393; published: 8/06/2010; Supplier_Name: Farnell; price: 0.218; value: 10uF 6V3
C36 = 33pF_CC0603: 0603 Capacitor; Supplier_Component_Code: RC-P053; published: 28/03/2007 10:54:57 a.m.; Supplier_Name: Soanar Plus; price: 0.06; value: 33pF; Part Number: 33pF_CC0603; Component Kind: Standard; Component Type: Standard; Designator: 33pF_CC0603; Pin Count: 2
C38 C39 = 15pF_CC0603: 0603 Capacitor; Supplier_Component_Code: RC-P051; published: 28/03/2007 10:54:57 a.m.; Supplier_Name: Soanar Plus; price: 0.06; value: 15pF; Part Number: 15pF_CC0603; Component Kind: Standard; Component Type: Standard; Designator: 15pF_CC0603; Pin Count: 2
L1 = 10uH_ferrite: 10uH ferrite bead; Manufacturer: Tyco Electronics; Part Number: BMB2A0300AN1; Order multiple: 10; Pack of: 1; price: 0.21; Supplier_Component_Code: 1193418; Supplier_Name: Farnell; published: 07/01/2008; value: 10uH
P3 = USBminiB: USB mini B-type connector, surface mount with shield; Manufacturer: Molex; Part Number: 678038020; Order multiple: 1; value: USB Mini-B; Supplier_Name: Farnell; Supplier_Component_Code: 1355761; price: 0.61; Pack of: 1
P4 = HEADER 2x5: SMD Header, 2x5, boxed; Manufacturer: 3M; Part Number: N2510-6V0C-RB-WD; Order multiple: 1; Supplier_Name: Digikey; Supplier_Component_Code: MSH10KCT-ND; price: 2.46; Pack of: 1; value: Header 2x5
Q9 = ZXM61P02F: 20V P-channel enhancement mode MOSFET; Manufacturer: Zetex; Order multiple: 5; Pack of: 1; Supplier_Name: Farnell; Supplier_Component_Code: 9525297; price: 1.31; published: 7/12/2007; Part Number: ZXM61P02F; value: ZXM61P02F
R14 = 1K5_R0603: 0603 Resistor; ECE_Component_Code: 1K5_R0603; value: 1K5; Supplier_Component_Code: RS-S077; published: 12/03/2007 11:34:34 a.m.; Supplier_Name: Soanar Plus; price: 0.08; Part Number: 1K5_R0603; Component Kind: Standard; Component Type: Standard; Designator: 1K5_R0603; Pin Count: 2
R15 R16 = 27R_R0603: 0603 Resistor; ECE_Component_Code: 27R_R0603; value: 27R; Supplier_Component_Code: RS-S035; published: 12/03/2007 11:34:33 a.m.; Supplier_Name: Soanar Plus; price: 0.08; Part Number: 27R_R0603; Component Kind: Standard; Component Type: Standard; Designator: 27R_R0603; Pin Count: 2
R17-R21 = 10K_R0603: 0603 Resistor; ECE_Component_Code: 10K_R0603; value: 10K; Supplier_Component_Code: RS-S097; published: 12/03/2007 11:34:34 a.m.; Supplier_Name: Soanar Plus; price: 0.08; Part Number: 10K_R0603; Component Kind: Standard; Component Type: Standard; Designator: 10K_R0603; Pin Count: 2
R45 R46 = 330K_R0603: 0603 Resistor; ECE_Component_Code: 330K_R0603; value: 330K; Supplier_Component_Code: RS-S133; published: 12/03/2007 11:34:34 a.m.; Supplier_Name: Soanar Plus; price: 0.08; Part Number: 330K_R0603; Component Kind: Standard; Component Type: Standard; Designator: 330K_R0603; Pin Count: 2
TP9-TP13 = SMTestPoint: as TP1 on sheet AT91; price: 40.01; published: 15/02/2010; Supplier_Name: Farnell; Supplier_Component_Code: 1022338; value: SMTestPoint
U8 = WT12_Bluetooth: Bluetooth Module Block; Manufacturer: Bluegiga; Part Number: WT12-A-AI; Pack of: 1; component_link1_url: http://www.semiconductorstore.com/cart/pc/viewPrd.asp?idproduct=5101; price: 71.61; Supplier_Name: Farnell; published: 15/02/2010; Supplier_Component_Code: 1656896; value: WT12; Order multiple: 1

## Sheet UserInterface.SchDoc: Treetap 7C - User Interface
size A3; Author: Treetap Group; DrawnBy: Treetap Group; Revision: 1; SheetNumber: 7; SheetTotal: 7; PageSetup: Record=PageOptions|CenterHorizontal=True|CenterVertical=True|PrintScale=1.03|XCorrection=1.00|YCorrection=1.00|PrintKind=1|BorderSize=5000000|LeftOffset=0|BottomOffset=0|Orientation=2|PaperLength=1000|PaperWidth=1000|Scale=100|PaperSource=15|PrintQuality=600|MediaType=1|DitherType=10|PaperKind=A3|PrintScaleMode=1
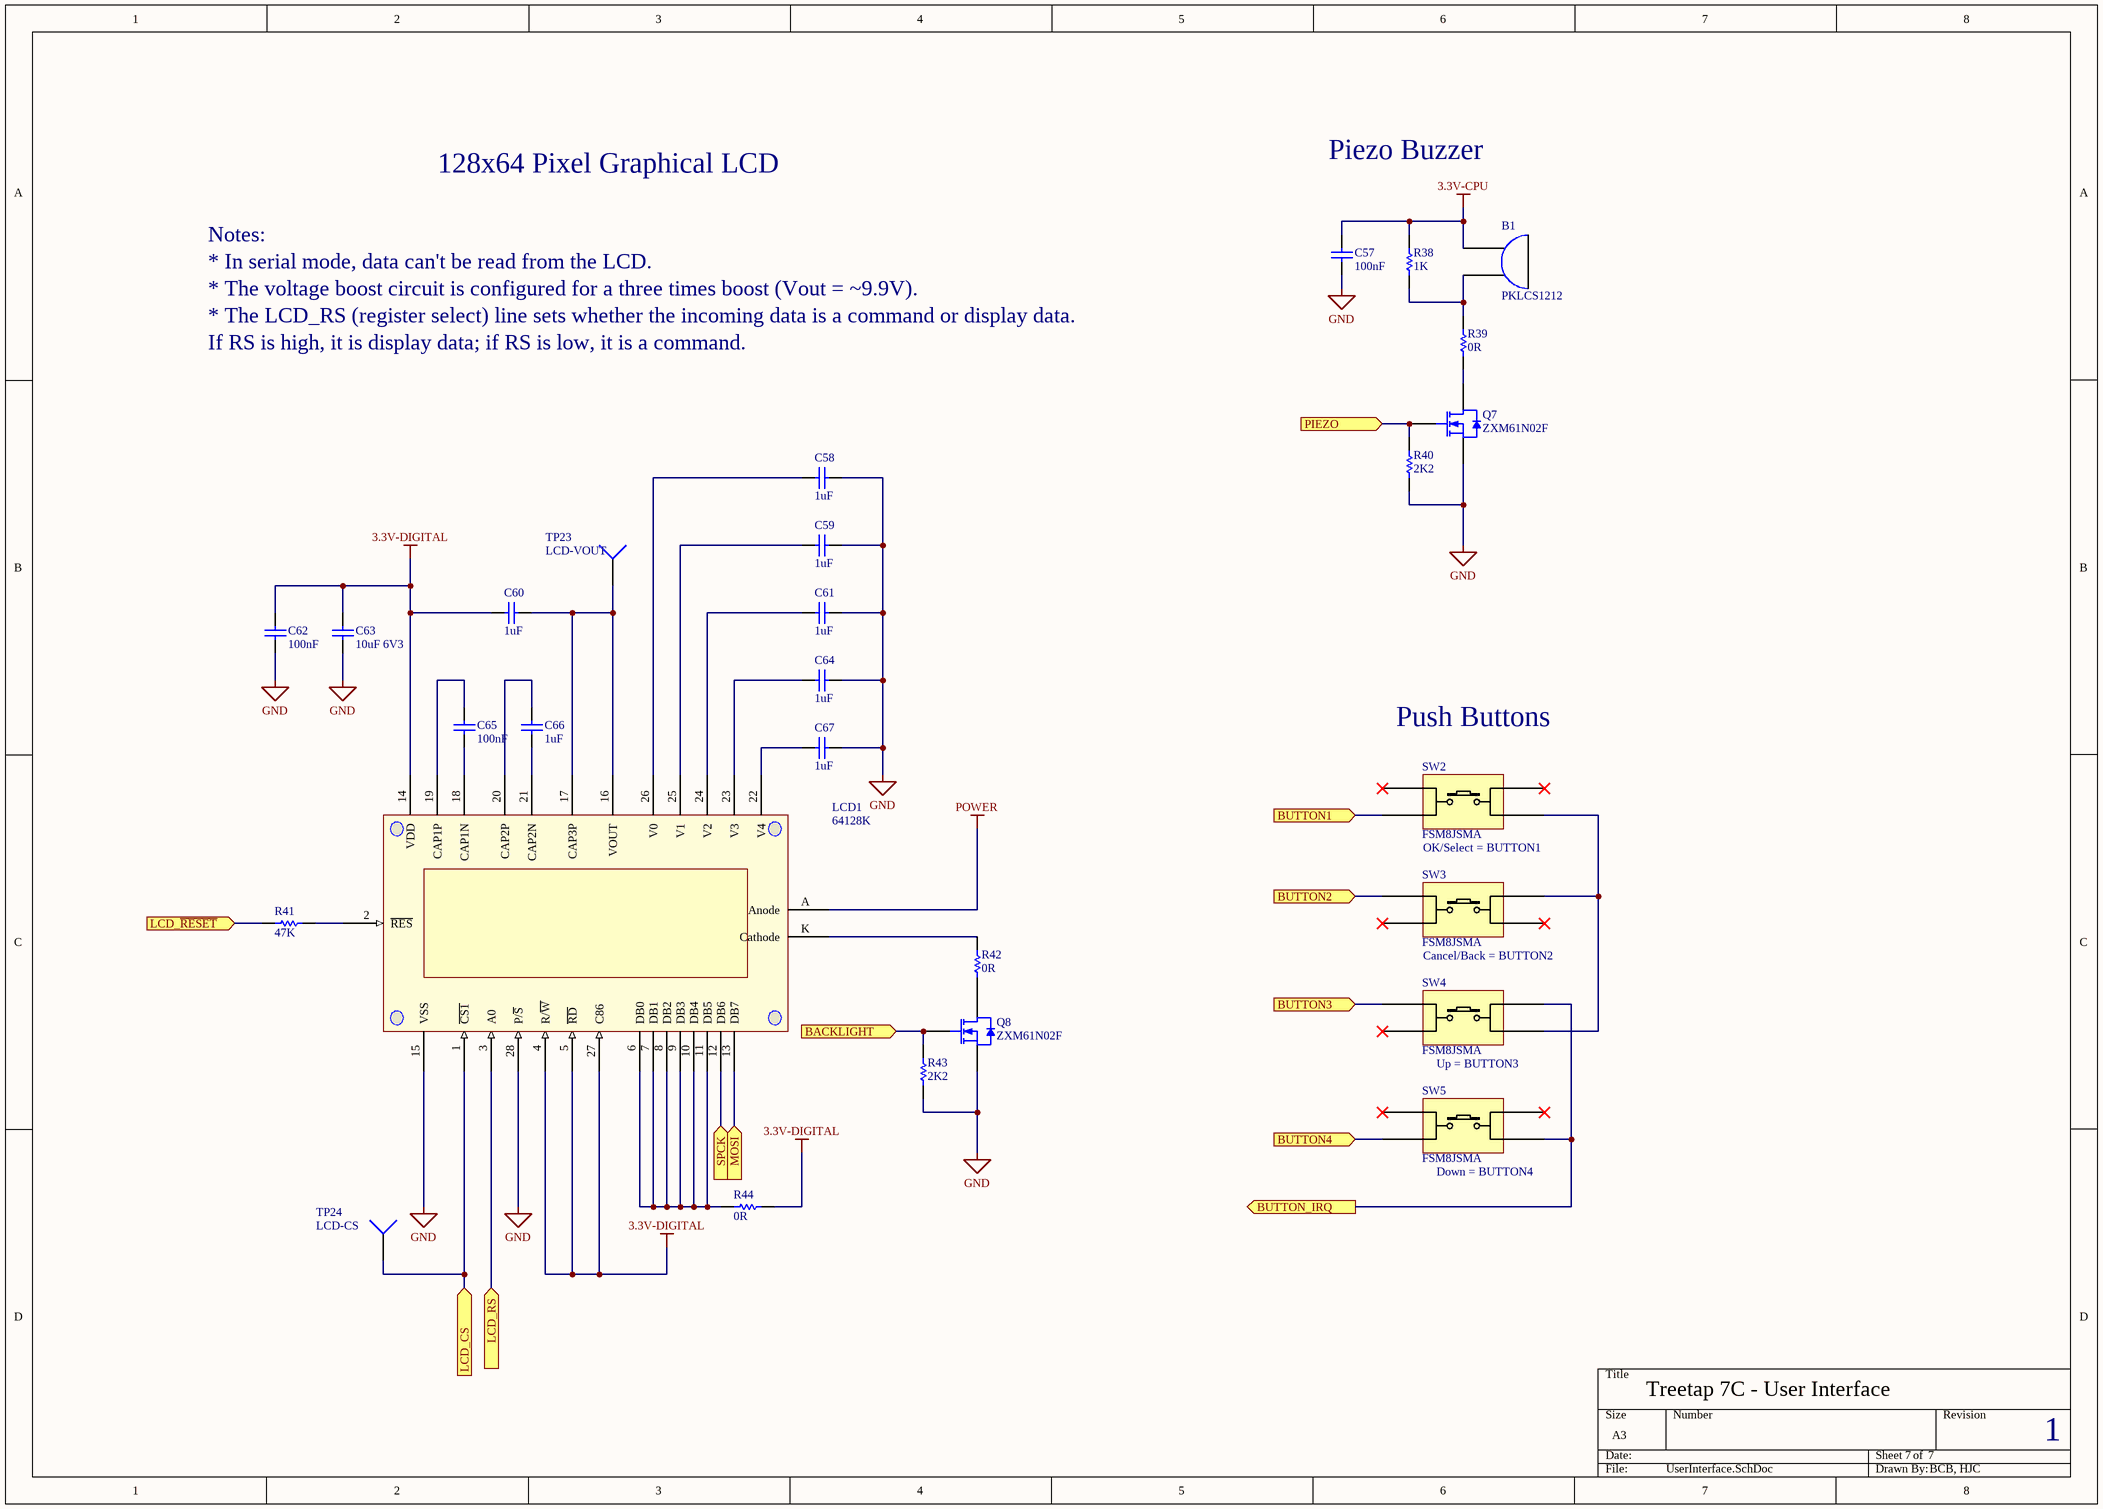
[diagram p4: UserInterface.SchDoc]

### Parts
B1  PKLCS1212  [PKSCL1212]
C57  100nF  [CC0603]
C58  1uF  [CC0603]
C59  1uF  [CC0603]
C60  1uF  [CC0603]
C61  1uF  [CC0603]
C62  100nF  [CC0603]
C63  10uF 6V3  [CC0603]
C64  1uF  [CC0603]
C65  100nF  [CC0603]
C66  1uF  [CC0603]
C67  1uF  [CC0603]
LCD1  64128K  [64128K]
Q7  ZXM61N02F  [SOT-23]
Q8  ZXM61N02F  [SOT-23]
R38  1K  [R0603]
R39  0R  [R0603]
R40  2K2  [R0603]
R41  47K  [R0603]
R42  0R  [R0603]
R43  2K2  [R0603]
R44  0R  [R0603]
SW2  FSM8JSMA  [FSM8JSMA]
SW3  FSM8JSMA  [FSM8JSMA]
SW4  FSM8JSMA  [FSM8JSMA]
SW5  FSM8JSMA  [FSM8JSMA]
TP23  LCD-VOUT  [SMTP_1]
TP24  LCD-CS  [SMTP_1]

### Ports
BACKLIGHT (in), BUTTON1 (in), BUTTON2 (in), BUTTON3 (in), BUTTON4 (in), BUTTON_IRQ (out), LCD_CS (in), LCD_RS (in), LCD_~{RESET} (in), MOSI (in), PIEZO (in), SPCK (in)

### Nets
3.3V-CPU: B1.0 C57.2 R38.2
3.3V-DIGITAL: C60.2 C62.2 C63.2 LCD1.4(R/~{W}) LCD1.5(~{RD}) LCD1.14(VDD) LCD1.27(C86) R44.2
GND: C57.1 C58.1 C59.1 C61.1 C62.1 C63.1 C64.1 C67.1 LCD1.15(VSS) LCD1.28(P/~{S}) Q7.2(S) Q8.2(S) R40.1 R43.1
POWER: LCD1.A(Anode)
BACKLIGHT: Q8.1(G) R43.2 ; port BACKLIGHT
BUTTON1: SW2.2 ; port BUTTON1
BUTTON2: SW3.1 ; port BUTTON2
BUTTON3: SW4.1 ; port BUTTON3
BUTTON4: SW5.2 ; port BUTTON4
BUTTON_IRQ: SW4.4 SW5.3 ; port BUTTON_IRQ
LCD_NPCS: LCD1.1(~{CS1}) TP24.1 ; port LCD_CS
LCD_RESET: R41.1 ; port LCD_~{RESET}
LCD_RS: LCD1.3(A0) ; port LCD_RS
MOSI: LCD1.13(DB7) ; port MOSI
PIEZO: Q7.1(G) R40.2 ; port PIEZO
SPCK: LCD1.12(DB6) ; port SPCK
NetB1_1: B1.1 R38.1 R39.2
NetC58_2: C58.2 LCD1.26(V0)
NetC59_2: C59.2 LCD1.25(V1)
NetC60_1: C60.1 LCD1.16(VOUT) LCD1.17(CAP3P) TP23.1
NetC61_2: C61.2 LCD1.24(V2)
NetC64_2: C64.2 LCD1.23(V3)
NetC65_1: C65.1 LCD1.18(CAP1N)
NetC65_2: C65.2 LCD1.19(CAP1P)
NetC66_1: C66.1 LCD1.21(CAP2N)
NetC66_2: C66.2 LCD1.20(CAP2P)
NetC67_2: C67.2 LCD1.22(V4)
NetLCD1_2: LCD1.2(~{RES}) R41.2
NetLCD1_6: LCD1.6(DB0) LCD1.7(DB1) LCD1.8(DB2) LCD1.9(DB3) LCD1.10(DB4) LCD1.11(DB5) R44.1
NetLCD1_K: LCD1.K(Cathode) R42.2
NetQ7_3: Q7.3(D) R39.1
NetQ8_3: Q8.3(D) R42.1
NetSW2_3: SW2.3 SW3.4 SW4.3

Not connected (* = marked no-connect by the designer): SW2 1* 4*; SW3 2* 3*; SW4 2*; SW5 1* 4*

### Notes on the sheet
- 128x64 Pixel Graphical LCD
- Piezo Buzzer
- Notes:
- * In serial mode, data can't be read from the LCD.
- * The voltage boost circuit is configured for a three times boost (Vout = ~9.9V).
- * The LCD_RS (register select) line sets whether the incoming data is a command or display data.
- If RS is high, it is display data; if RS is low, it is a command.
- Push Buttons
- OK/Select = BUTTON1
- Cancel/Back = BUTTON2
- Up = BUTTON3
- (near SW5) Down = BUTTON4
- Treetap 7C - User Interface
- 7
- 1
- BCB, HJC

### Library data of the parts
B1 = PKLCS1212: 4kHz surface mount piezo; Manufacturer: Murata; Part Number: PKLCS1212E4001-R1; Order multiple: 1; price: 10.40; Supplier_Name: RS Components; Supplier_Component_Code: 619-8456; published: 15/02/2010; value: PKLCS1212; Pack of: 1
C57 C62 C65 = 100nF_CC0603: 0603 Capacitor; Supplier_Component_Code: RC-P100; published: 28/03/2007 10:54:57 a.m.; Supplier_Name: Soanar Plus; price: 0.09; value: 100nF; Part Number: 100nF_CC0603; Component Kind: Standard; Component Type: Standard; Designator: 100nF_CC0603; Pin Count: 2
C58-C61 C64 C66 C67 = 1uF_0603_25V_ceramic: as C31 on sheet Power; Supplier_Component_Code: 1288202; published: 15/02/2010; Supplier_Name: Farnell; price: 0.465; value: 1uF
C63 = 10uF_CC0603_6V3: as C8 on sheet AT91; Supplier_Component_Code: 1759393; published: 8/06/2010; Supplier_Name: Farnell; price: 0.218; value: 10uF 6V3
LCD1 = 64128K: 64x128 COG LCD module; Part Number: 64128K-FC-BW-3; Manufacturer: Displaytech; Order multiple: 1; Supplier_Name: RS Components; Supplier_Component_Code: 564-399; price: 28.20; Published: 23/02/2010; Pack of: 1; value: 64128K
Q7 Q8 = ZXM61N02F: 20V N-channel enhancement mode MOSFET; Manufacturer: Zetex; Order multiple: 5; Pack of: 1; Supplier_Name: Farnell; Supplier_Component_Code: 9525270; price: 1.28; published: 7/12/2007; value: ZXM61N02F; Part Number: ZXM61N02F
R38 = 1K_R0603: 0603 Resistor; ECE_Component_Code: 1K_R0603; value: 1K; Supplier_Component_Code: RS-S073; published: 12/03/2007 11:34:34 a.m.; Supplier_Name: Soanar Plus; price: 0.08; Part Number: 1K_R0603; Component Kind: Standard; Component Type: Standard; Designator: 1K_R0603; Pin Count: 2
R39 R42 R44 = 0R_R0603: 0603 Resistor; ECE_Component_Code: 0R_R0603; Supplier_Component_Code: RS-S000; published: 12/03/2007 11:34:33 a.m.; Supplier_Name: Soanar Plus; price: 0.08; value: 0R; Part Number: 0R_R0603; Component Kind: Standard; Component Type: Standard; Designator: 0R_R0603; Pin Count: 2
R40 R43 = 2K2_R0603: 0603 Resistor; ECE_Component_Code: 2K2_R0603; value: 2K2; Supplier_Component_Code: RS-S081; published: 12/03/2007 11:34:34 a.m.; Supplier_Name: Soanar Plus; price: 0.08; Part Number: 2K2_R0603; Component Kind: Standard; Component Type: Standard; Designator: 2K2_R0603; Pin Count: 2
R41 = 47K_R0603: 0603 Resistor; ECE_Component_Code: 47K_R0603; value: 47K; Supplier_Component_Code: RS-S113; published: 12/03/2007 11:34:34 a.m.; Supplier_Name: Soanar Plus; price: 0.08; Part Number: 47K_R0603; Component Kind: Standard; Component Type: Standard; Designator: 47K_R0603; Pin Count: 2
SW2-SW5 = FSM8JSMA: DPST SMD Switch; Manufacturer: Tyco Electronics; Order multiple: 25; Pack of: 1; value: FSM8JSMA; Supplier_Name: Farnell; price: 0.61; Part Number: FSM8JSMA; Supplier_Component_Code: 1555992
TP23 TP24 = SMTestPoint: as TP1 on sheet AT91; price: 40.01; published: 15/02/2010; Supplier_Name: Farnell; Supplier_Component_Code: 1022338; value: SMTestPoint

## Nets that join several sheets
3.3V-BT: Power (C27.2 U5.5), Communications (6 pins)
3.3V-CPU: AT91 (12 pins), Power (C21.2 U2.5), Communications (7 pins), UserInterface (B1.0 C57.2 R38.2)
3.3V-DIGITAL: AT91 (C18.2 C68.2 P1.4), Power (C25.2 C30.2 U4.5 U7.8), UserInterface (8 pins)
GND: AT91 (35 pins), Power (32 pins), Communications (19 pins), UserInterface (14 pins)
POWER: AT91 (C13.2), Power (8 pins), UserInterface (LCD1.A)
USB-POWER: Power (7 pins), Communications (L1.2)
ADC_BAT: AT91 (U1.4), Power (U7.1 U7.2)
BACKLIGHT: AT91 (U1.32), UserInterface (Q8.1 R43.2)
BT_CTS: AT91 (U1.25), Communications (U8.5)
BT_RESET: AT91 (U1.38), Communications (TP11.1 U8.17)
BT_RTS: AT91 (U1.23), Communications (U8.10)
BT_RXD: AT91 (U1.11), Communications (TP12.1 U8.26)
BT_TXD: AT91 (U1.14), Communications (TP13.1 U8.6)
BUTTON1: AT91 (U1.34), UserInterface (SW2.2)
BUTTON2: AT91 (U1.26), UserInterface (SW3.1)
BUTTON3: AT91 (U1.16), UserInterface (SW4.1)
BUTTON4: AT91 (U1.52), UserInterface (SW5.2)
BUTTON_IRQ: AT91 (U1.42), UserInterface (SW4.4 SW5.3)
CHARGE_COMPLETE: AT91 (U1.3), Power (U6.4)
DDM: AT91 (U1.56), Communications (C38.2 R15.2 R45.2 TP9.1)
DDP: AT91 (U1.57), Communications (C39.2 R16.2 R46.2 TP10.1)
EN_ANALOG: AT91 (U1.35), Power (R4.2 U3.3)
EN_BT: AT91 (U1.9), Power (R5.2 U5.3)
EN_DIGITAL: AT91 (U1.41), Power (R3.2 U4.3)
LCD_NPCS: AT91 (U1.28), UserInterface (LCD1.1 TP24.1)
LCD_RESET: AT91 (U1.10), UserInterface (R41.1)
LCD_RS: AT91 (U1.31), UserInterface (LCD1.3)
MOSI: AT91 (P1.3 R47.2 TP2.1 U1.22), UserInterface (LCD1.13)
NRST: AT91 (SW1.1 U1.39), Communications (P4.5 R21.1)
PIEZO: AT91 (U1.48), UserInterface (Q7.1 R40.2)
SPCK: AT91 (P1.5 R1.2 TP1.1 U1.21), UserInterface (LCD1.12)
TCK: AT91 (U1.53), Communications (P4.6 R20.1)
TDI: AT91 (U1.33), Communications (P4.10 R18.1)
TDO: AT91 (U1.49), Communications (P4.4 R19.1)
TMS: AT91 (U1.51), Communications (P4.8)
USB_CONNECTED: AT91 (U1.13), Power (R9.1 R10.2)
USB_ENABLE: AT91 (U1.15), Communications (Q9.1)